# EAGLE schematic ESP32 Schema (EAGLE 9.5.1)
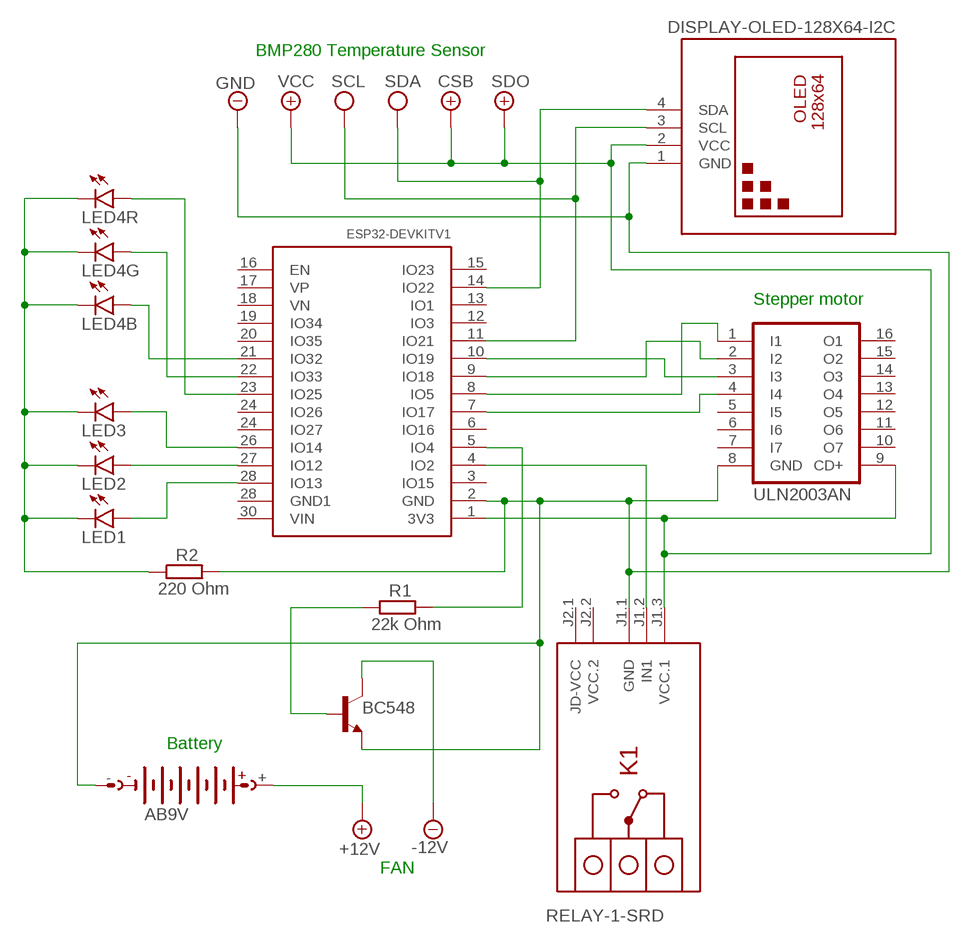
[diagram p0: schematic, sheet 1]

## Parts
G1  AB9V  [AB9V]
IC2  ULN2003AN  [DIL16]
LED1  LED5MM  [LED5MM]
LED2  LED5MM  [LED5MM]
LED3  LED5MM  [LED5MM]
LED4  GM5WA94310A  [GM5WA94310A]
Q1  BC548  [TO92-EBC]
R1  22k Ohm  R-EU_0207/10  [0207/10]
R2  220 Ohm  R-EU_0207/10  [0207/10]
U$1  ESP32DEVKITV1  [ESP32-DEVKITV1]
U$2  DISPLAY-OLED-128X64-I2C  [DISPLAY-OLED-128X64-I2C]
U$3  RELAY-1-SRD  [RELAY-1-SRD]

## Nets
+4.1V: IC2.9(CD+) U$1.1(3V3) U$2.2(VCC) U$3.J1.3(VCC.1) ; supply symbol labelled SDO, CSB, VCC
+12V: G1.+
-5V: G1.- IC2.8(GND) Q1.E R2.2 U$1.2(GND) U$2.1(GND) U$3.J1.1(GND) ; supply symbol labelled GND
-12V: Q1.C
N$1: LED1.A U$1.28(IO13)
N$2: LED2.A U$1.27(IO12)
N$3: LED3.A U$1.26(IO14)
N$4: LED4.2(R:A) U$1.23(IO25)
N$5: LED4.3(G:A) U$1.22(IO33)
N$6: LED4.1(B:A) U$1.21(IO32)
N$7: U$1.4(IO2) U$3.J1.2(IN1)
N$8: R1.2 U$1.5(IO4)
N$9: Q1.B R1.1
N$10: IC2.3(I3) U$1.10(IO19)
N$11: IC2.2(I2) U$1.9(IO18)
N$12: IC2.1(I1) U$1.8(IO5)
N$13: IC2.4(I4) U$1.7(IO17)
N$14: LED1.K(C) LED2.K(C) LED3.K(C) LED4.4(G:C) LED4.5(R:C) LED4.6(B:C) R2.1
VCC: U$1.11(IO21) U$1.14(IO22) U$2.3(SCL) U$2.4(SDA) ; supply symbol labelled SCL, SDA
Unconnected: IC2.5(I5) IC2.6(I6) IC2.7(I7) IC2.10(O7) IC2.11(O6) IC2.12(O5) IC2.13(O4) IC2.14(O3) IC2.15(O2) IC2.16(O1) U$1.3(IO15) U$1.6(IO16) U$1.12(IO3) U$1.13(IO1) U$1.15(IO23) U$1.16(EN) U$1.17(VP) U$1.18(VN) U$1.19(IO34) U$1.20(IO35) U$1.24(IO26) U$1.24(IO27) U$1.28(GND1) U$1.30(VIN) U$3.J2.1(JD-VCC)

## Notes on the sheet
- BMP280 Temperature Sensor
- Stepper motor
- Battery
- FAN

## Power pins joined to a net without a drawn wire
VCC.2: U$3.J2.2(VCC.2)

## Library data of the parts
G1 = battery:AB9V: 9-V BATTERY CLIP
IC2 = uln-udn:ULN2003A: DRIVER ARRAY
LED1-LED3 = led:LED: LED OSRAM: - CHIPLED LG R971, LG N971, LY N971, LG Q971, LY Q971, LO R971, LY R971 LH N974, LH R974 LS Q976, LO Q976, LY Q976 LO Q996 - Hyper CHIPLED LW Q18S LB Q993, LB Q99A, LB R99A - SideLED LS A670, LO A670, LY A670, LG A670, LP A670 LB A673, LV A673, LT A673, LW A673 LH A674 LY A675 LS A676, LA A676, LO A676, LY A676, LW A676 LS A679, LY A679, LG A679 - Hyper Micro SIDELED® LS Y876, LA Y876, LO Y876, LY Y876 LT Y87S - SmartLED LW L88C, LW L88S LB L89C, LB L89S, LG L890 LS L89K, LO L89K, LY L89K LS L896, LA L896, LO L896, LY L896 - TOPLED LS T670, LO T670, LY T670, LG T670, LP T670 LSG T670, LSP T670, LSY T670, LOP T670, LYG T670 LG T671, LOG T671, LSG T671 LB T673, LV T673, LT T673, LW T673 LH T674 LS T676, LA T676, LO T676, LY T676, LB T676, LH T676, LSB T676, LW T676 LB T67C, LV T67C, LT T67C, LS T67K, LO T67K, LY T67K, LW E67C LS E67B, LA E67B, LO E67B, LY E67B, LB E67C, LV E67C, LT E67C LW T67C LS T679, LY T679, LG T679 LS T770, LO T770, LY T770, LG T770, LP T770 LB T773, LV T773, LT T773, LW T773 LH T774 LS E675, LA E675, LY E675, LS T675 LS T776, LA T776, LO T776, LY T776, LB T776 LHGB T686 LT T68C, LB T68C - Hyper Mini TOPLED® LB M676 - Mini TOPLED Santana® LG M470 LS M47K, LO M47K, LY M47K Source: http://www.osram.convergy.de LUXEON: - LUMILED® LXK2-PW12-R00, LXK2-PW12-S00, LXK2-PW14-U00, LXK2-PW14-V00 LXK2-PM12-R00, LXK2-PM12-S00, LXK2-PM14-U00 LXK2-PE12-Q00, LXK2-PE12-R00, LXK2-PE12-S00, LXK2-PE14-T00, LXK2-PE14-U00 LXK2-PB12-K00, LXK2-PB12-L00, LXK2-PB12-M00, LXK2-PB14-N00, LXK2-PB14-P00, LXK2-PB14-Q00 LXK2-PR12-L00, LXK2-PR12-M00, LXK2-PR14-Q00, LXK2-PR14-R00 LXK2-PD12-Q00, LXK2-PD12-R00, LXK2-PD12-S00 LXK2-PH12-R00, LXK2-PH12-S00 LXK2-PL12-P00, LXK2-PL12-Q00, LXK2-PL12-R00 Source: www.luxeon.com KINGBRIGHT: KA-3528ASYC Source: www.kingbright.com
LED4 = led:GM5WA94310A: Chip LED RGB Source: http://document.sharpsma.com/files/GM5WA94310A_SS.pdf
Q1 = transistor-npn:BC548*: NPN Transistor
R1 R2 = rcl:R-EU_: RESISTOR, European symbol; SPICEPREFIX: R
U$1 = ESP32-DEVKITV1:ESP32DEVKITV1
U$2 = diy-modules:DISPLAY-OLED-128X64-I2C: 128x64 Dot Matrix OLED Module based on SSD1306 chip Variant with I2C interface More details available here: http://www.instructables.com/id/Monochrome-096-i2c-OLED-display-with-arduino-SSD13/ SSD1306 datasheet: https://cdn-shop.adafruit.com/datasheets/SSD1306.pdf Click here to find device on ebay.com <http://www.ebay.com/sch/oled+display+128x64+iic> Note: There are two variants: I2C and SPI. Search for the proper version.
U$3 = diy-modules:RELAY-1-SRD: 1-Channel Relay Module based on SRD-05VDC-SL-C relays Click here to find device on ebay.com <http://www.ebay.com/sch/one+channel+isolated+relay+5v>